# EAGLE design EAT0002 (EAGLE 7.2.0)
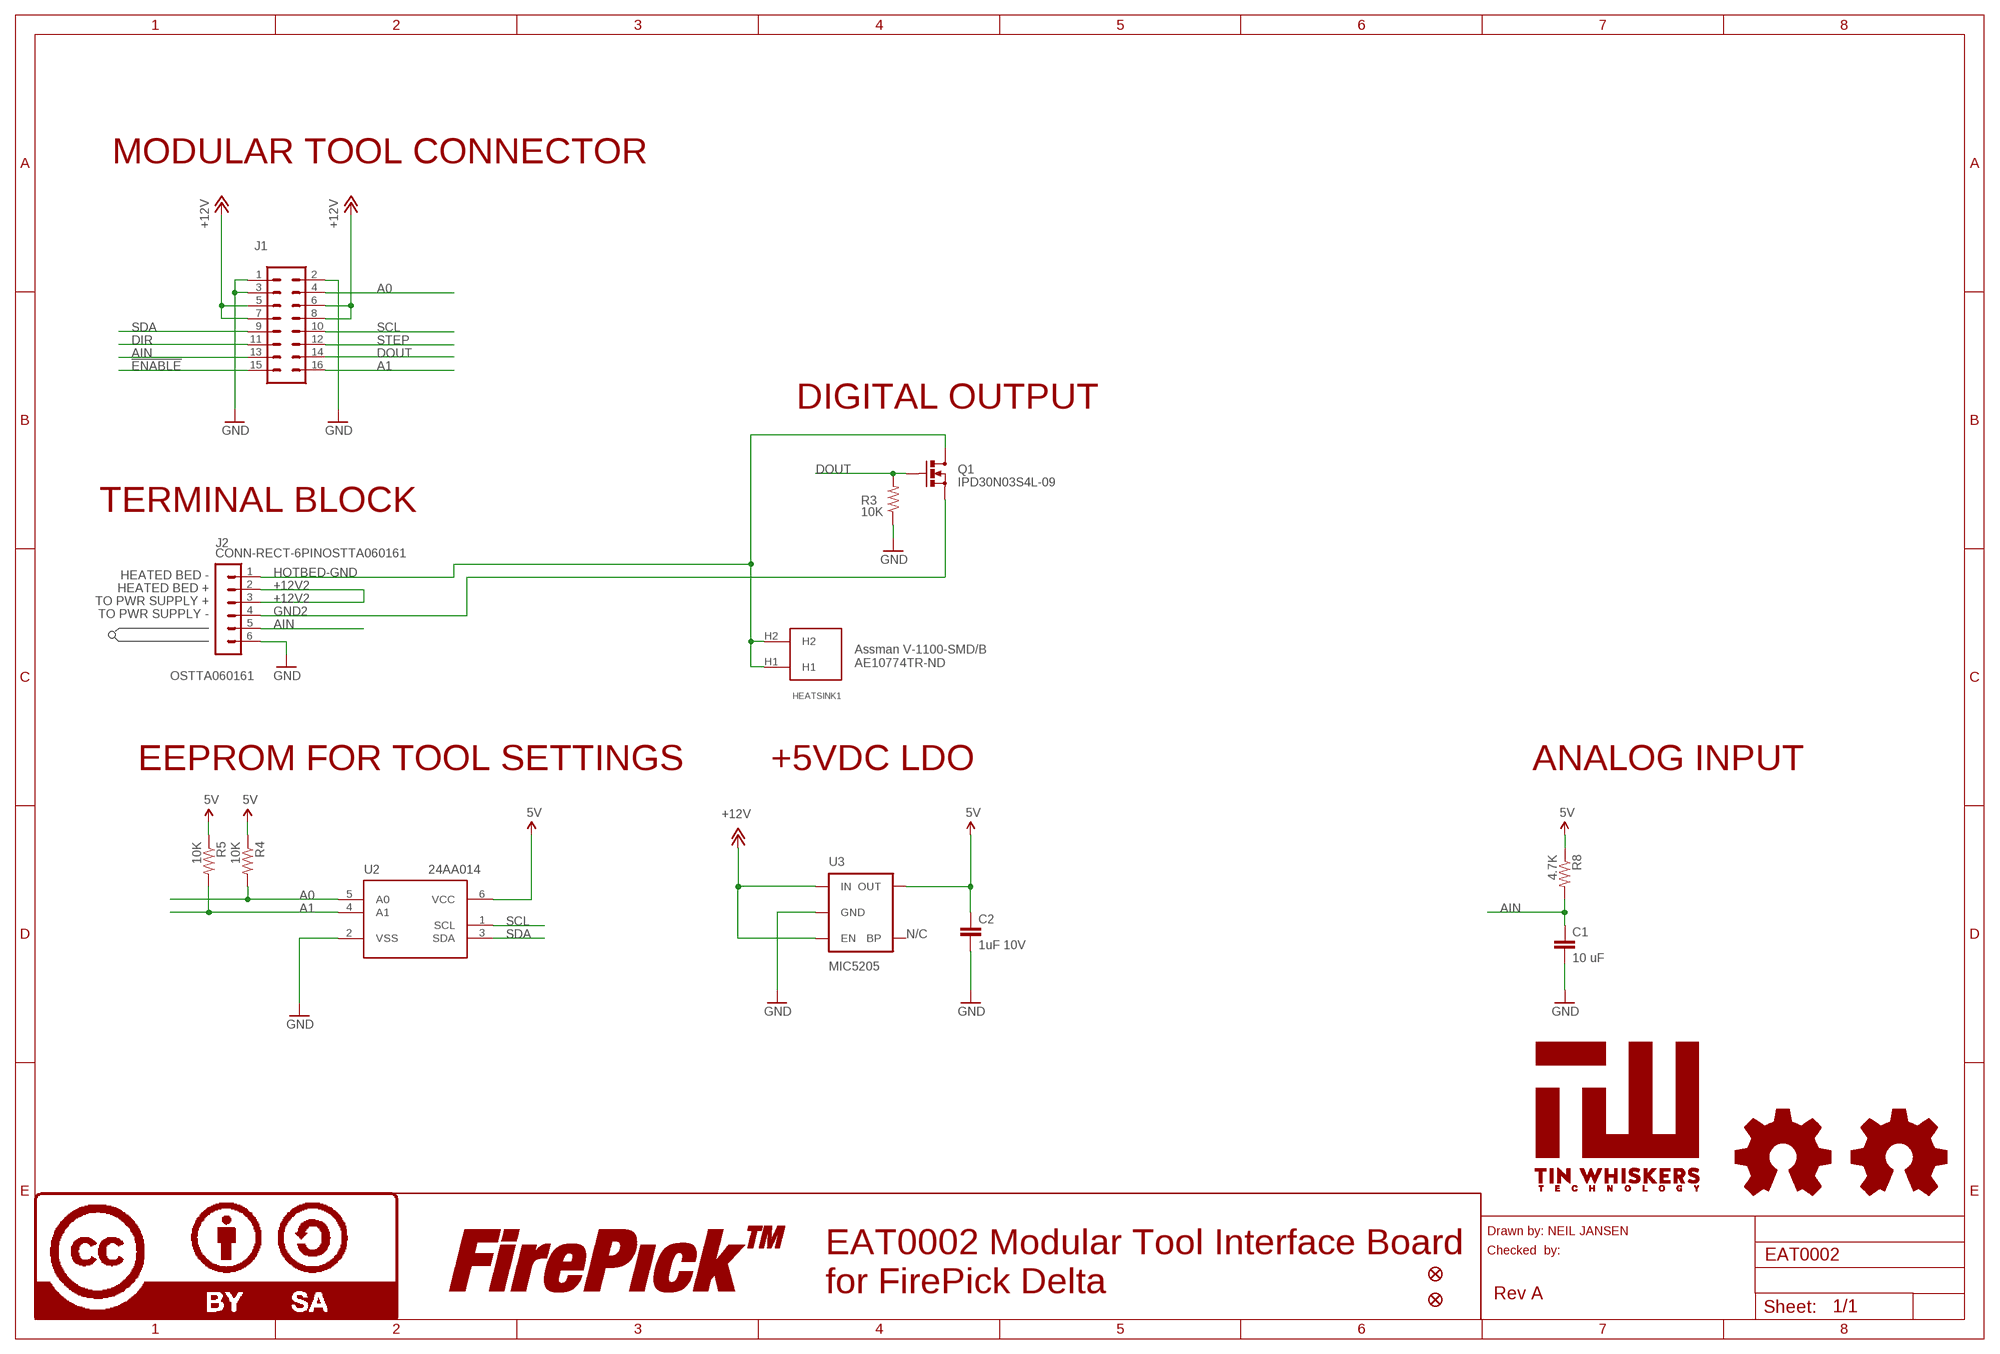
[diagram p0: schematic, sheet 1]

## Parts
C1  10 uF  CAP0805  [0805]
C2  1uF 10V  CAP0805  [0805]
FID1  FIDUCIAL  [FIDUCIAL]
FID2  FIDUCIAL  [FIDUCIAL]
HEATSINK1  HEATSINK-DPAK  [HEATSINK-DPAK]
J1  CONN-RECT-16PIN-2ROWSIDE  [CONN-RECT-2.54MM-16PIN-2ROW-SIDE]
J2  CONN-RECT-6PINOSTTA060161  [CONN-OSTTA060161]
LOGO1  LOGO-OSHWSMALL  [LOGO-OSHW-SMALL]
LOGO4  LOGO-FIREPICKMEDIUM  [LOGO-FIREPICK-MEDIUM]
LOGO5  LOGO-OSHWSMALL  [LOGO-OSHW-SMALL]
LOGO6  LOGO-CC-BY-SAMEDIUM  [LOGO-CC-BY-SA-MEDIUM]
Q1  IPD30N03S4L-09  MOSFET-NCHANNELFDD8580  [DPAK]
R3  10K  RESISTOR0805-RES  [0805]
R4  10K  RESISTOR0805-RES  [0805]
R5  10K  RESISTOR0805-RES  [0805]
R8  4.7K  RESISTOR0805-RES  [0805]
U2  24AA014  IC-24AA014  [SOT23-6]
U3  MIC5205  MIC52055V  [SOT23-5]
U$1  TIN-WHISKERSSMALL  [TIN-WHISKERS-SMALL]

## Nets
5V [power]: C2.1 R4.1 R5.1 R8.1 U2.6(VCC) U3.5(OUT)
!ENABLE: J1.15
+12V [power-12V]: J1.5 J1.6 J1.7 J1.8 U3.1(IN) U3.3(EN)
+12V2: J2.2 J2.3
A0: J1.4 R4.2 U2.5(A0)
A1: J1.16 R5.2 U2.4(A1)
AIN: C1.1 J1.13 J2.5 R8.2
DIR: J1.11
DOUT: J1.14 Q1.1(G) R3.2
GND: C1.2 C2.2 J1.1 J1.2 J1.3 J2.6 R3.1 U2.2(VSS) U3.2(GND)
GND2: J2.4 Q1.3(S)
HOTBED-GND [power-12V]: HEATSINK1.H1 HEATSINK1.H2 J2.1 Q1.4(D)
SCL: J1.10 U2.1(SCL)
SDA: J1.9 U2.3(SDA)
STEP: J1.12
Unconnected: U3.4(BP)

## Notes on the sheet
- MODULAR TOOL CONNECTOR
- DIGITAL OUTPUT
- TERMINAL BLOCK
- HEATED BED -
- HEATED BED +
- TO PWR SUPPLY +
- TO PWR SUPPLY -
- Assman V-1100-SMD/B
  AE10774TR-ND
- OSTTA060161
- EEPROM FOR TOOL SETTINGS | +5VDC LDO | ANALOG INPUT
- N/C
- Drawn by: NEIL JANSEN
- Checked  by:
- EAT0002 Modular Tool Interface Board
  for FirePick Delta
- Rev A

## Library data of the parts
C1 = SparkFun-Capacitors:CAP: Capacitor Standard 0603 ceramic capacitor, and 0.1" leaded capacitor.; PARTNO: CC0805ZKY5V6BB106
C2 = SparkFun-Capacitors:CAP: Capacitor Standard 0603 ceramic capacitor, and 0.1" leaded capacitor.; PARTNO: CC0805KKX7R7BB105
FID1 FID2 = FirePick:FIDUCIAL; DNP: T
HEATSINK1 = FirePick:HEATSINK-DPAK; PARTNO: V-1100-SMD/B
J1 = FirePick:CONN-RECT-16PIN-2ROW; PARTNO: CONN-0.1-S-2x8
J2 = FirePick:CONN-RECT-6PIN; PARTNO: OSTTA060161
LOGO1 LOGO5 = FirePick:LOGO-OSHW; BOM: EXCLUDE; DNP: TRUE
LOGO4 = FirePick:LOGO-FIREPICK; BOM: EXCLUDE; DNP: T
LOGO6 = FirePick:LOGO-CC-BY-SA; BOM: EXCLUDE; DNP: T
Q1 = SparkFun:MOSFET-NCHANNEL; PARTNO: IPD30N03S4L-09
R3-R5 = SparkFun-Resistors:RESISTOR: Resistor Basic schematic elements and footprints for 0603, 1206, and PTH resistors.; PARTNO: RC0805FR-0710KL
R8 = SparkFun-Resistors:RESISTOR: Resistor Basic schematic elements and footprints for 0603, 1206, and PTH resistors.; PARTNO: RC0805FR-074K7L
U2 = FirePick:IC-24AA014; PARTNO: 24AA014T-I/OT
U3 = SparkFun-PowerIC:MIC5205: MIC5205 150mA vreg 3.3V - VREG-00822 5V - VREG-00823; PARTNO: MIC5205-5.0YM5 TR; PROD_ID: VREG-00823
U$1 = !tin-whiskers:TIN-WHISKERS; BOM: EXCLUDE; DNP: T

## Net classes
0 default: width 0.3 mm, drill 0.3 mm, clearance 0.3 mm
1 power: width 0.3 mm, drill 0.3 mm, clearance 0.3 mm
2 power-12V: width 0.3 mm, drill 0.3 mm, clearance 0.3 mm

## Board
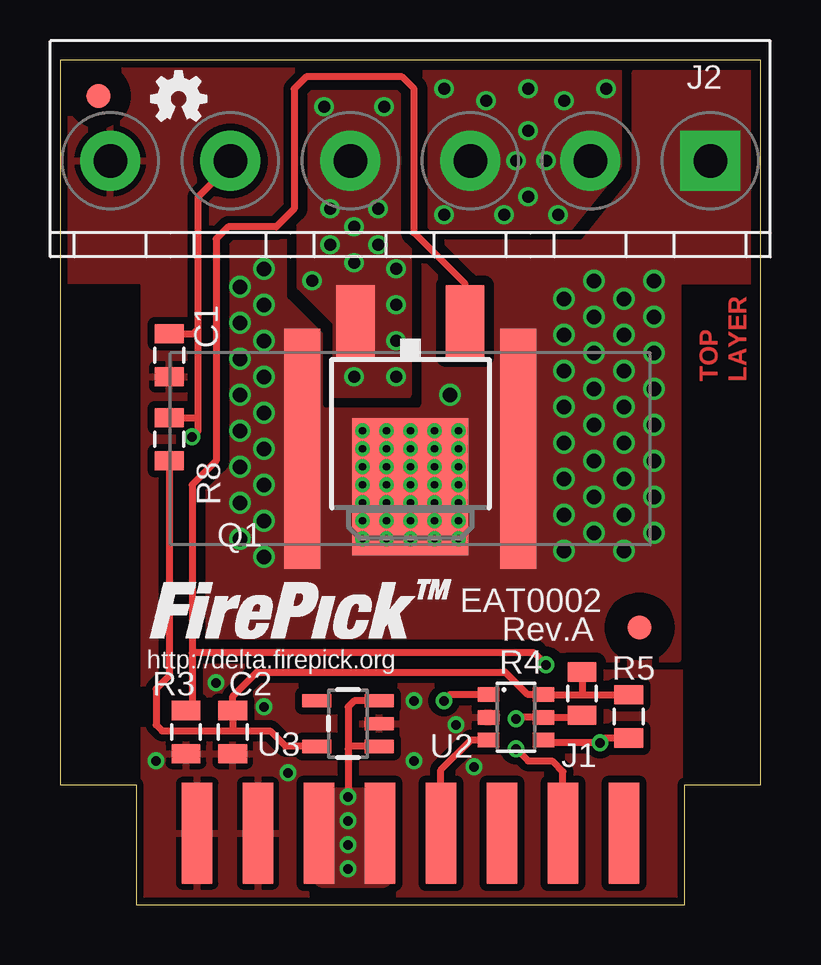
[diagram p1: board, top side]
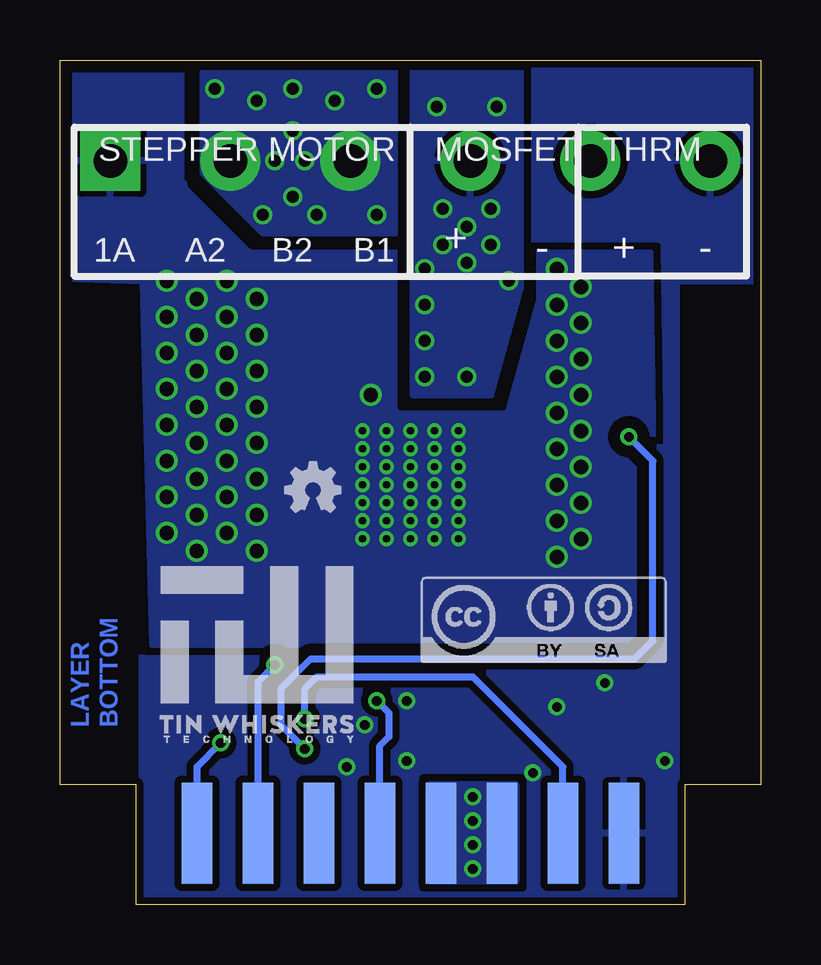
[diagram p2: board, bottom side, seen from below]

Size 29.2 x 35.2 mm. Coordinates in mm from the lower left corner, seen from the top.
Outline: 3.17,0 26.03,0 26.03,5 29.2,5 29.2,35.2 0,35.2 0,5 3.17,5 3.17,0
Copper layers (1*16): Top 0.035mm / dielectric 1.5mm / Bottom 0.035mm
Design rules "SeeedStudio_2layer_DRU_no_angle_20140221": minimum track width 6mil, minimum drill 12mil, track to track 6mil, track to pad 6mil, pad to pad 6mil, via to via 6mil, smd to smd 0mil, copper to edge 10mil, drill to drill 10mil, minimum pad ring 10mil, minimum via ring 6mil, stop-mask expansion 2mil, vias tented up to drill 100mil, thermal gap 10mil

### Footprints (pad centres in the part's own frame; a part is rotated, then mirrored left to right if it is on the bottom)
0805 = smd 0.8 x 1.2: 1 -0.9,0; 2 0.9,0
FIDUCIAL = smd 1 x 1: 1 0,0
HEATSINK-DPAK = smd 1.5 x 10: H1 -4.5,0; H2 4.5,0
CONN-RECT-2.54MM-16PIN-2ROW-SIDE = smd 1.27 x 4.2: 1 -8.89,-0.02; 3 -6.35,-0.02; 5 -3.81,-0.02; 7 -1.27,-0.02; 9 1.27,-0.02; 11 3.81,-0.02; 13 6.35,-0.02; 15 8.89,-0.02 | smd 1.27 x 4.2 bottom: 2 -8.89,-0.02; 4 -6.35,-0.02; 6 -3.81,-0.02; 8 -1.27,-0.02; 10 1.27,-0.02; 12 3.81,-0.02; 14 6.35,-0.02; 16 8.89,-0.02
CONN-OSTTA060161 = drill 1.4 pad 2.5 square: 1 -12.5,0 | drill 1.4 pad 2.5: 2 -7.5,0; 3 -2.5,0; 4 2.5,0; 5 7.5,0; 6 12.5,0
DPAK = smd 1.6 x 3: 1 -2.28,-5.31; 3 2.28,-5.31 | smd 4.826 x 5.715: 4 0,1.588
SOT23-6 = smd 0.6 x 0.9: 1 -0.95,-1.15; 2 0,-1.15; 3 0.95,-1.15; 4 0.95,1.15; 5 0,1.15; 6 -0.95,1.15
SOT23-5 = smd 0.55 x 1.2: 1 -0.95,-1.3; 2 0,-1.3; 3 0.95,-1.3; 4 0.95,1.3; 5 -0.95,1.3

### Placement (x,y rotation side)
C1  4.55,22.9 270 top
C2  7.2,7.2 270 top
FID1  1.6,33.7 0 top
FID2  24.15,11.55 0 top
HEATSINK1  14.6,19 180 top
J1  14.6,3 0 top
J2  14.6,31 180 top
LOGO1  19.9,16.15 0 bottom
LOGO4  3.75,11.1 0 top
LOGO5  3.7,32.45 0 top
LOGO6  14.15,10.1 0 bottom
Q1  14.6,19 180 top
R3  5.25,7.2 90 top
R4  21.75,8.8 270 top
R5  23.7,7.85 270 top
R8  4.55,19.4 90 top
U2  19,7.81 270 top
U3  12,7.55 90 top
U$1  25.5,6.5 0 bottom

### Tracks (layer width: path | path; a pad name or v marks a point on that pad's centre or on a via)
5V
  Top 0.3: 21.75,8.76 U2.6 19.49,8.76 18.55,9.7 8.2,9.7 7.2,8.7 C2.1 7.2,7.3 7.25,7.25 | 21.75,8.76 23.19,8.76 R5.1 | R4.1 21.75,8.76 | R8.1 4.55,9.55 4,9 4,7.5 4.25,7.25 7.25,7.25 | 7.25,7.25 8.75,7.25 9.4,6.6 U3.5
+12V  (via drill 0.4)
  Top 0.3: U3.3 12.25,8.5 12,8.25 12,6.5 | 12,6.5 v12,4.5 | U3.1 12.1,6.6 12,6.5
  other vias: 12,3.5 12,2.5 12,1.5
  pour Top (isolate 0.3, no thermals): 11,4.4 13.4,4.4 13.4,1.2 11,1.2
  pour Bottom (no thermals): 10.2,5 13.8,5 13.8,1 10.2,1
+12V2  (via drill 0.5)
  other vias: 16,28.75 20.75,28.75 22.75,34 16,34 18.5,28.75 19.5,29.5 19.5,32.25 19.5,34 17.75,33.5 21,33.5 19,31 20.25,31
  pour Bottom (isolate 0.406, no thermals): 15.25,34.75 23.25,34.75 23.25,30.5 20.75,28 15.25,28
  pour Top (isolate 0.406, no thermals): 15.25,34.75 23.25,34.75 23.25,30.75 21.25,28.25 15.25,28.25
A0  (via drill 0.4)
  Top 0.3: R4.2 21.61,7.81 U2.5 19.06,7.81 v19,7.75
  Bottom 0.3: J1.4 8.25,5.75 12,9.5 18.5,9.5 19,9 v19,7.75
A1  (via drill 0.4)
  Top 0.3: U2.4 20.26,6.75 v22.5,6.75 22.7,6.95 R5.2
  Bottom 0.3: J1.16 23.49,5.76 v22.5,6.75
AIN  (via drill 0.4)
  Top 0.3: J2.5 7.1,30.85 5.75,29.5 5.75,24 | J1.13 20.95,5.55 20.5,6 19.5,6 v19,6.5 | 5.75,20.25 5.75,19.75 v5.5,19.5 | 5.75,20.25 5.75,24 | C1.1 5.55,23.8 5.75,24 | R8.2 5.7,20.3 5.75,20.25
  Bottom 0.3: v19,6.5 20,7.5 20,9 18.75,10.25 5.25,10.25 4.5,11 4.5,18.5 v5.5,19.5
DOUT  (via drill 0.4)
  Top 0.3: Q1.1 16.88,25.87 14.75,28 14.75,34 14.25,34.5 10.25,34.5 9.75,34 9.75,29 9,28.25 7,28.25 6.5,27.75 6.5,18.5 5.5,17.5 5.5,10.5 | 5.5,10.5 5.5,8.25 R3.2 | v20.25,10 19.75,10.5 5.5,10.5
  Bottom 0.3: J1.14 20.95,9.3 v20.25,10
GND  (via drill 0.4)
  other vias: 16.5,7.5 8.5,8.25 6.5,9.25 4,6 14.75,8.5 14.75,6 9.5,5.5 17.25,5.75
  pour Top (isolate 0.3, rank 3): 0,35 29.1,35 29.1,26 25.8,26 25.8,0 3.5,0 3.5,26 0,26
  pour Bottom (isolate 0.3, rank 3): 29.1,35 29.1,26 25.8,26 25.8,0.2 3.5,0.2 3.5,26 0,26 0,35
GND2  (via drill 0.5)
  other vias: 11.25,27.5 12.25,26.75 12.25,28.25 13.25,27.5 11.25,29 13.25,29 10.5,26 14,26.5 11,33.25 13.5,33.25 12.25,22 14,25 14,23.5 14,22
  pour Top (isolate 0.406, no thermals): 10,34.75 14.5,34.75 14.5,21.25 11.5,21.25 11.5,24.25 10,25.75
  pour Bottom (isolate 0.406): 10,34.75 14.5,34.75 14.5,21.25 11.25,21.25 10,25.75
HOTBED-GND  (via drill 0.3, 0.6)
  other vias: 7.5,15.25 21,14.75 7.5,16.75 7.5,18.25 7.5,19.75 7.5,21.25 7.5,22.75 7.5,24.25 7.5,25.75 21,16.25 21,17.75 21,19.25 21,20.75 21,22.25 21,23.75 21,25.25 8.5,26.5 8.5,25 8.5,23.5 8.5,22 8.5,20.5 8.5,19 8.5,17.5 8.5,16 8.5,14.5 16.25,21.25 14.6,19.75 14.6,18.25 14.6,16.75 14.6,15.25 13.6,16 15.6,16 15.6,17.5 13.6,17.5 13.6,19 15.6,19 14.6,19 14.6,17.5 14.6,16 15.6,18.25 15.6,19.75 13.6,19.75 13.6,18.25 13.6,16.75 15.6,16.75 15.6,15.25 13.6,15.25 16.6,16 16.6,17.5 16.6,19 16.6,19.75 16.6,18.25 16.6,16.75 16.6,15.25 12.6,16 12.6,17.5 12.6,19 12.6,19.75 12.6,18.25 12.6,16.75 12.6,15.25 22.25,15.5 22.25,17 22.25,18.5 22.25,20 22.25,21.5 22.25,23 22.25,24.5 22.25,26 23.5,14.75 23.5,16.25 23.5,17.75 23.5,19.25 23.5,20.75 23.5,22.25 23.5,23.75 23.5,25.25 24.75,15.5 24.75,17 24.75,18.5 24.75,20 24.75,21.5 24.75,23 24.75,24.5 24.75,26
  pour Bottom (isolate 0.5, rank 2): 29.1,34.9 29.1,26.1 25.75,26 25.35,10.85 4.35,10.85 4.6,27.15 21.25,27.15 24.15,30.15 24.15,34.9
  pour Top (isolate 0.406, rank 2, no thermals): 5.75,27.75 5.75,10.25 25.75,10.25 25.75,26 29.25,26 28.75,29 28.75,34.75 24,34.75 21.25,27.75
SCL  (via drill 0.4)
  Top 0.3: U2.1 16.26,8.76 v16,8.5
  Bottom 0.3: v16,8.5 15.5,8 15.5,7 15.87,6.63 J1.10
SDA
  Top 0.3: J1.9 15.87,5.62 17.11,6.86 U2.3

### Text on the board
Top: TOP | LAYER
Bottom: BOTTOM | LAYER
tPlace: EAT0002 | Rev.A | http://delta.firepick.org
bPlace: THRM | MOSFET | STEPPER MOTOR | - | + | - | + | B1 | B2 | A2 | 1A